# EAGLE design Backplane (EAGLE 4.16)
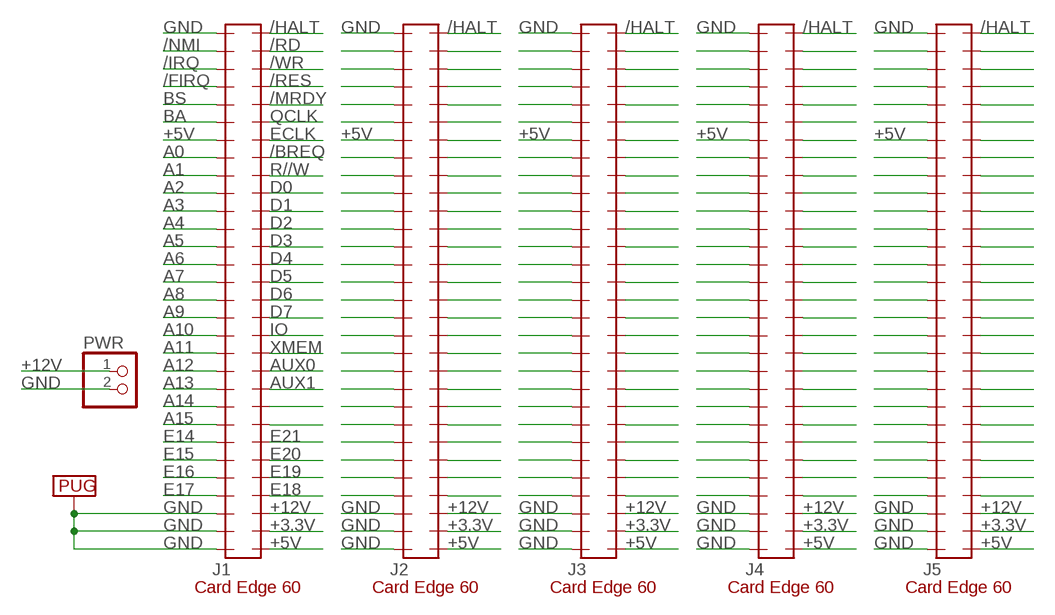
[diagram p0: schematic, sheet 1]

## Parts
J1  CARDEDGE_2.54_60POSSOCKET  [CARDSOCKET_2.54_60POS]
J2  CARDEDGE_2.54_60POSSOCKET  [CARDSOCKET_2.54_60POS]
J3  CARDEDGE_2.54_60POSSOCKET  [CARDSOCKET_2.54_60POS]
J4  CARDEDGE_2.54_60POSSOCKET  [CARDSOCKET_2.54_60POS]
J5  CARDEDGE_2.54_60POSSOCKET  [CARDSOCKET_2.54_60POS]
PWR  PINHD-1X2  [1X02]
U$1  PUGSMALL  [SMALL_PUG]

## Nets
+3.3V [power]: J1.P$32 J2.P$32 J3.P$32 J4.P$32 J5.P$32
+5V [power]: J1.P$7 J1.P$31 J2.P$7 J2.P$31 J3.P$7 J3.P$31 J4.P$7 J4.P$31 J5.P$7 J5.P$31
+12V [power]: J1.P$33 J2.P$33 J3.P$33 J4.P$33 J5.P$33 PWR.1
/BREQ: J1.P$53 J2.P$53 J3.P$53 J4.P$53 J5.P$53
/FIRQ: J1.P$4 J2.P$4 J3.P$4 J4.P$4 J5.P$4
/HALT: J1.P$60 J2.P$60 J3.P$60 J4.P$60 J5.P$60
/IRQ: J1.P$3 J2.P$3 J3.P$3 J4.P$3 J5.P$3
/MRDY: J1.P$56 J2.P$56 J3.P$56 J4.P$56 J5.P$56
/NMI: J1.P$2 J2.P$2 J3.P$2 J4.P$2 J5.P$2
/RD: J1.P$59 J2.P$59 J3.P$59 J4.P$59 J5.P$59
/RES: J1.P$57 J2.P$57 J3.P$57 J4.P$57 J5.P$57
/WR: J1.P$58 J2.P$58 J3.P$58 J4.P$58 J5.P$58
A0: J1.P$8 J2.P$8 J3.P$8 J4.P$8 J5.P$8
A1: J1.P$9 J2.P$9 J3.P$9 J4.P$9 J5.P$9
A2: J1.P$10 J2.P$10 J3.P$10 J4.P$10 J5.P$10
A3: J1.P$11 J2.P$11 J3.P$11 J4.P$11 J5.P$11
A4: J1.P$12 J2.P$12 J3.P$12 J4.P$12 J5.P$12
A5: J1.P$13 J2.P$13 J3.P$13 J4.P$13 J5.P$13
A6: J1.P$14 J2.P$14 J3.P$14 J4.P$14 J5.P$14
A7: J1.P$15 J2.P$15 J3.P$15 J4.P$15 J5.P$15
A8: J1.P$16 J2.P$16 J3.P$16 J4.P$16 J5.P$16
A9: J1.P$17 J2.P$17 J3.P$17 J4.P$17 J5.P$17
A10: J1.P$18 J2.P$18 J3.P$18 J4.P$18 J5.P$18
A11: J1.P$19 J2.P$19 J3.P$19 J4.P$19 J5.P$19
A12: J1.P$20 J2.P$20 J3.P$20 J4.P$20 J5.P$20
A13: J1.P$21 J2.P$21 J3.P$21 J4.P$21 J5.P$21
A14: J1.P$22 J2.P$22 J3.P$22 J4.P$22 J5.P$22
A15: J1.P$23 J2.P$23 J3.P$23 J4.P$23 J5.P$23
AUX0: J1.P$41 J2.P$41 J3.P$41 J4.P$41 J5.P$41
AUX1: J1.P$40 J2.P$40 J3.P$40 J4.P$40 J5.P$40
BA: J1.P$6 J2.P$6 J3.P$6 J4.P$6 J5.P$6
BS: J1.P$5 J2.P$5 J3.P$5 J4.P$5 J5.P$5
D0: J1.P$51 J2.P$51 J3.P$51 J4.P$51 J5.P$51
D1: J1.P$50 J2.P$50 J3.P$50 J4.P$50 J5.P$50
D2: J1.P$49 J2.P$49 J3.P$49 J4.P$49 J5.P$49
D3: J1.P$48 J2.P$48 J3.P$48 J4.P$48 J5.P$48
D4: J1.P$47 J2.P$47 J3.P$47 J4.P$47 J5.P$47
D5: J1.P$46 J2.P$46 J3.P$46 J4.P$46 J5.P$46
D6: J1.P$45 J2.P$45 J3.P$45 J4.P$45 J5.P$45
D7: J1.P$44 J2.P$44 J3.P$44 J4.P$44 J5.P$44
E14: J1.P$24 J2.P$24 J3.P$24 J4.P$24 J5.P$24
E15: J1.P$25 J2.P$25 J3.P$25 J4.P$25 J5.P$25
E16: J1.P$26 J2.P$26 J3.P$26 J4.P$26 J5.P$26
E17: J1.P$27 J2.P$27 J3.P$27 J4.P$27 J5.P$27
E18: J1.P$34 J2.P$34 J3.P$34 J4.P$34 J5.P$34
E19: J1.P$35 J2.P$35 J3.P$35 J4.P$35 J5.P$35
E20: J1.P$36 J2.P$36 J3.P$36 J4.P$36 J5.P$36
E21: J1.P$37 J2.P$37 J3.P$37 J4.P$37 J5.P$37
ECLK: J1.P$54 J2.P$54 J3.P$54 J4.P$54 J5.P$54
GND: J1.P$1 J1.P$28 J1.P$29 J1.P$30 J2.P$1 J2.P$28 J2.P$29 J2.P$30 J3.P$1 J3.P$28 J3.P$29 J3.P$30 J4.P$1 J4.P$28 J4.P$29 J4.P$30 J5.P$1 J5.P$28 J5.P$29 J5.P$30 PWR.2 U$1.P$1
IO: J1.P$43 J2.P$43 J3.P$43 J4.P$43 J5.P$43
N$34: J1.P$38 J2.P$38 J3.P$38 J4.P$38 J5.P$38
N$35: J1.P$39 J2.P$39 J3.P$39 J4.P$39 J5.P$39
QCLK: J1.P$55 J2.P$55 J3.P$55 J4.P$55 J5.P$55
R//W: J1.P$52 J2.P$52 J3.P$52 J4.P$52 J5.P$52
XMEM: J1.P$42 J2.P$42 J3.P$42 J4.P$42 J5.P$42

## Library data of the parts
J1-J5 = 07-Retrocomputing:CARDEDGE_2.54_60POS
PWR = pinhead:PINHD-1X2: PIN HEADER
U$1 = 07-Retrocomputing:PUG

## Net classes
0 default: width 0.203 mm, drill 0.203 mm
1 power: width 0.61 mm, drill 0.305 mm, clearance 0.406 mm

## Board
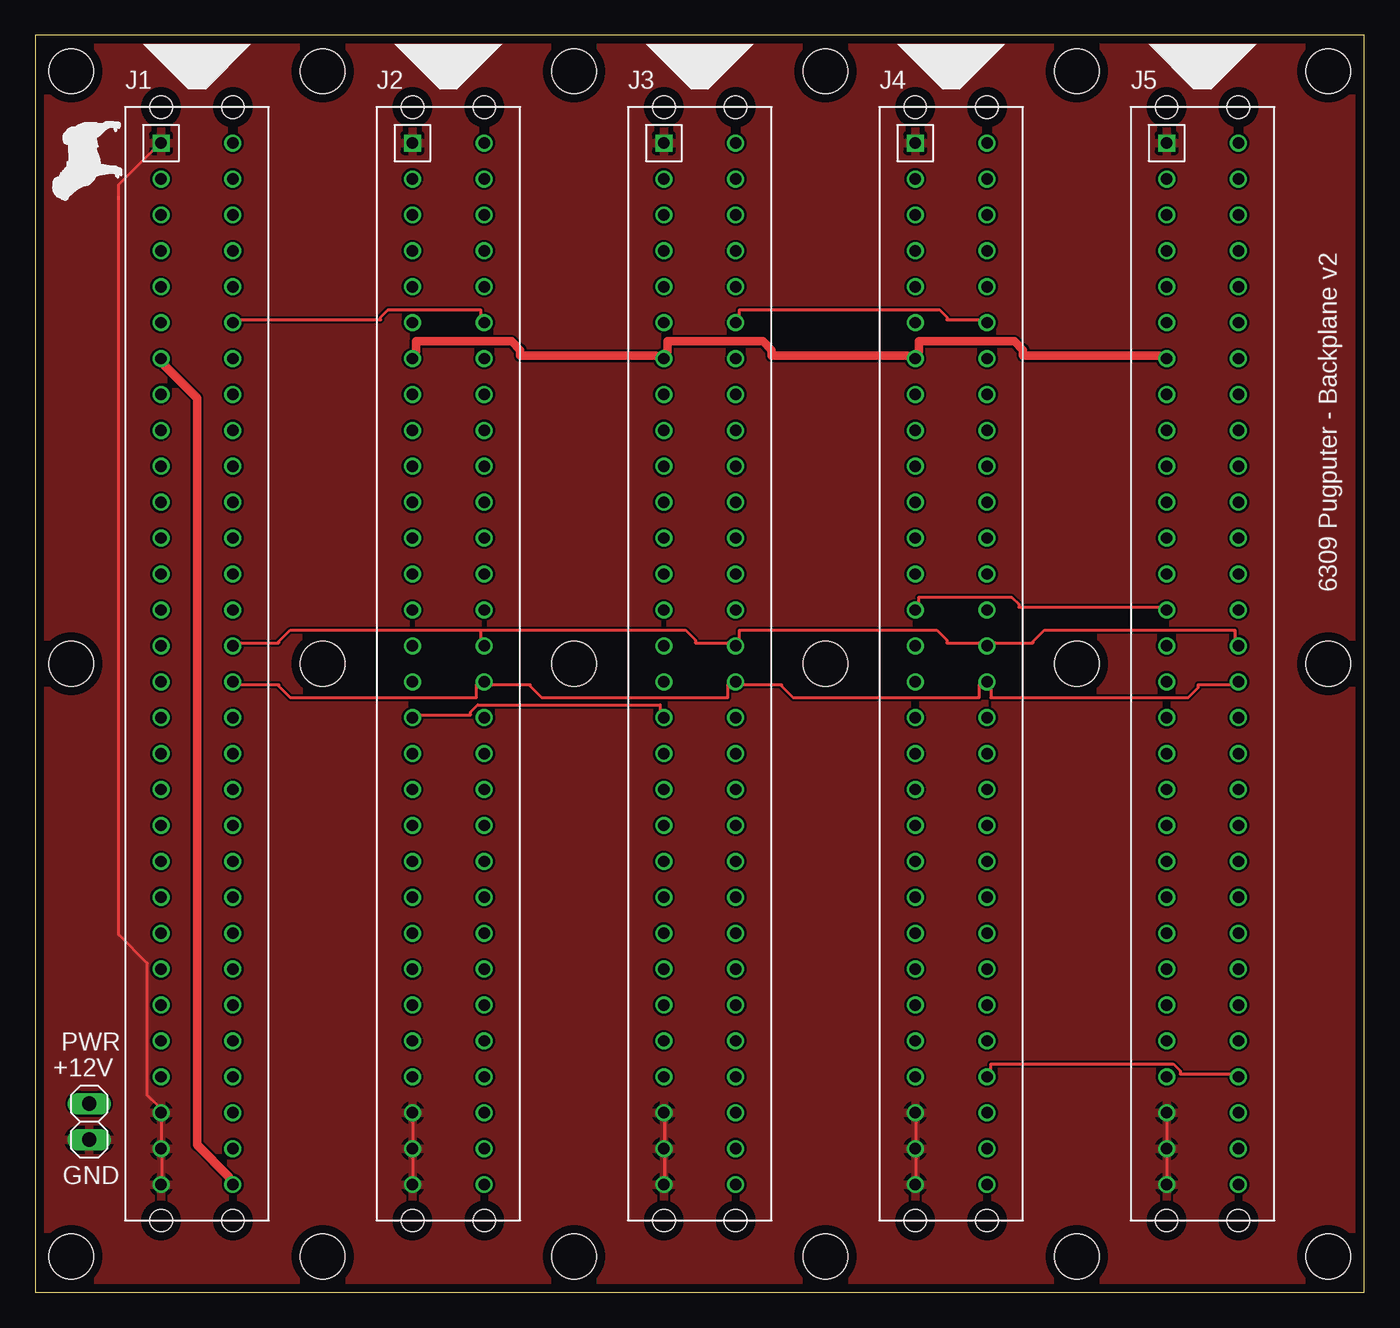
[diagram p1: board, top side]
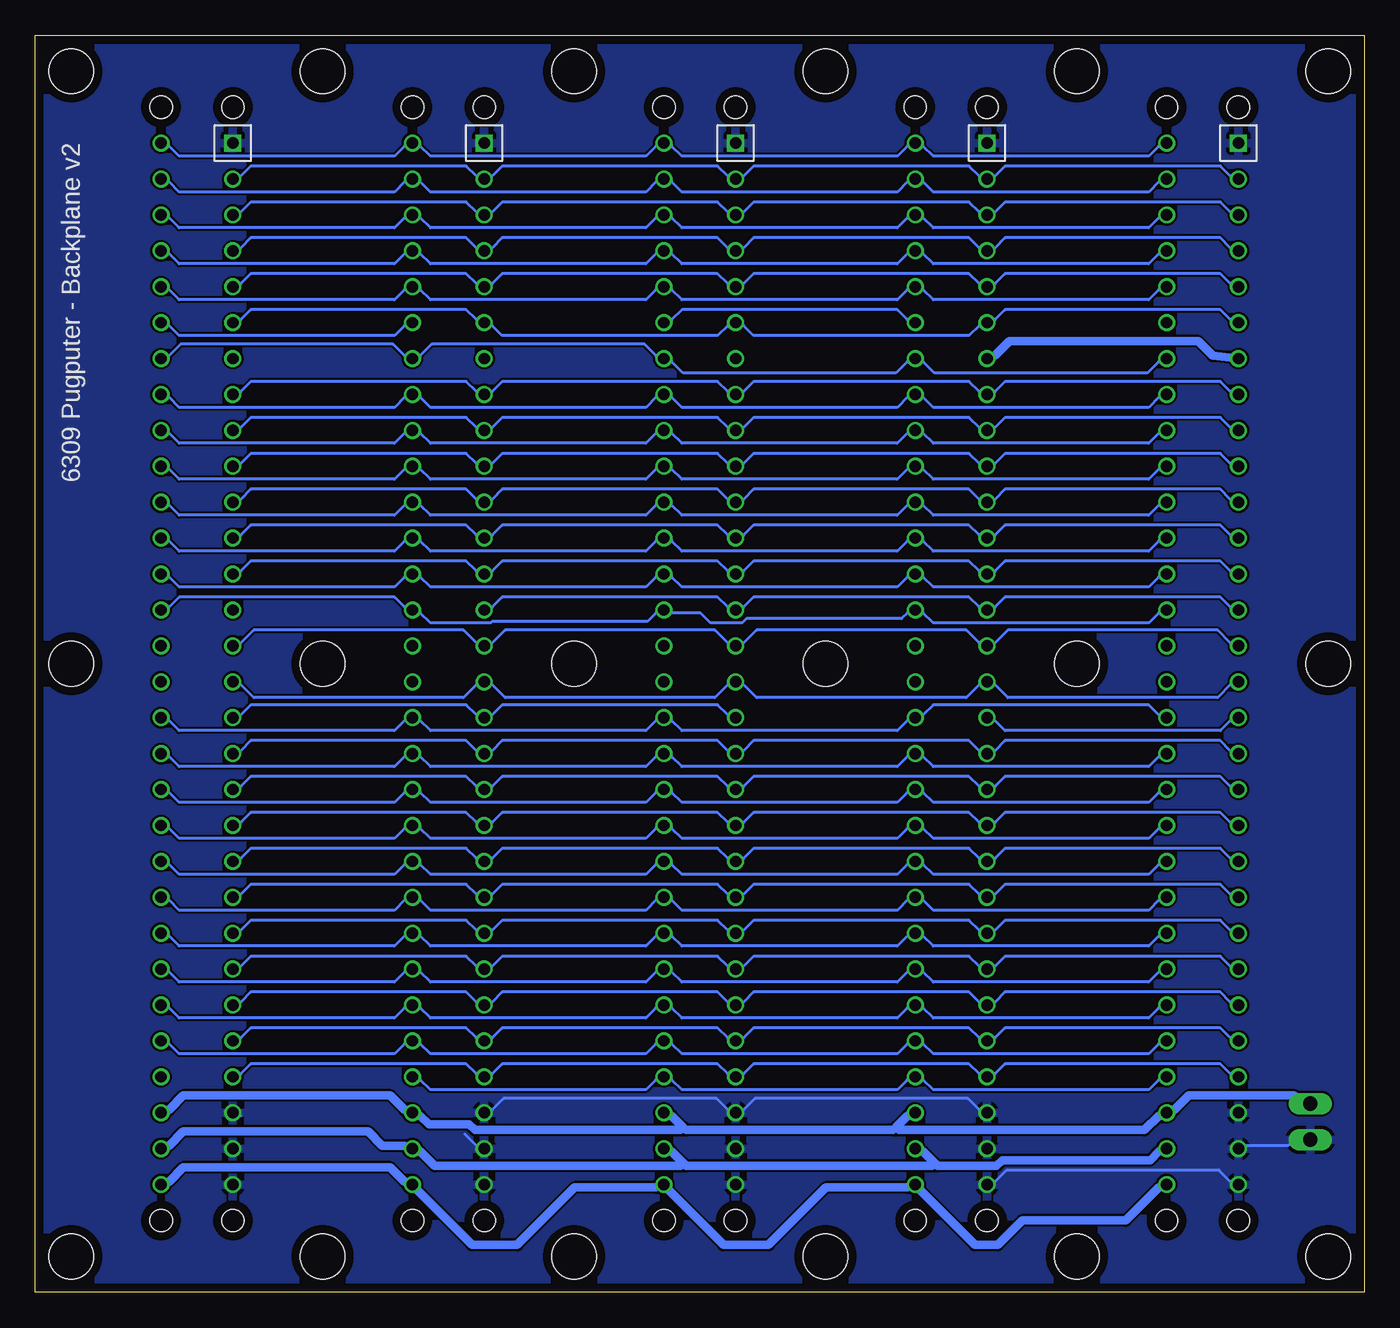
[diagram p2: board, bottom side, seen from below]

Size 93.98 x 88.9 mm. Coordinates in mm from the lower left corner, seen from the top.
Outline: 0,0 93.98,0 93.98,88.9 0,88.9 0,0
Copper layers (1*16): Top 0.0356mm / dielectric 1.6mm / Bottom 0.0356mm
Design rules "oshpark-2layer": minimum track width 6mil, minimum drill 10mil, track to track 6mil, track to pad 6mil, pad to pad 6mil, via to via 6mil, smd to smd 6mil, copper to edge 24mil, drill to drill 24mil, minimum pad ring 5mil, minimum via ring 5mil, stop-mask expansion 2.5mil, vias tented up to drill 0mil, thermal gap 10mil
Holes 3.17 mm at 2.54,86.36 2.54,2.54 91.44,86.36 91.44,2.54 73.66,2.54 55.88,2.54 38.1,2.54 20.32,2.54 20.32,86.36 38.1,86.36 55.88,86.36 73.66,86.36 2.54,44.45 20.32,44.45 38.1,44.45 55.88,44.45 73.66,44.45 91.44,44.45

### Footprints (pad centres in the part's own frame; a part is rotated, then mirrored left to right if it is on the bottom)
CARDSOCKET_2.54_60POS = drill 0.8 square: P$1 -36.83,-2.54 | drill 0.8 round: P$2 -34.29,-2.54; P$3 -31.75,-2.54; P$4 -29.21,-2.54; P$5 -26.67,-2.54; P$6 -24.13,-2.54; P$7 -21.59,-2.54; P$8 -19.05,-2.54; P$9 -16.51,-2.54; P$10 -13.97,-2.54; P$11 -11.43,-2.54; P$12 -8.89,-2.54; P$13 -6.35,-2.54; P$14 -3.81,-2.54; P$15 -1.27,-2.54; P$16 1.27,-2.54; P$17 3.81,-2.54; P$18 6.35,-2.54; P$19 8.89,-2.54; P$20 11.43,-2.54; P$21 13.97,-2.54; P$22 16.51,-2.54; P$23 19.05,-2.54; P$24 21.59,-2.54; P$25 24.13,-2.54; P$26 26.67,-2.54; P$27 29.21,-2.54; P$28 31.75,-2.54; P$29 34.29,-2.54; P$30 36.83,-2.54; P$31 36.83,2.54; P$32 34.29,2.54; P$33 31.75,2.54; P$34 29.21,2.54; P$35 26.67,2.54; P$36 24.13,2.54; P$37 21.59,2.54; P$38 19.05,2.54; P$39 16.51,2.54; P$40 13.97,2.54; P$41 11.43,2.54; P$42 8.89,2.54; P$43 6.35,2.54; P$44 3.81,2.54; P$45 1.27,2.54; P$46 -1.27,2.54; P$47 -3.81,2.54; P$48 -6.35,2.54; P$49 -8.89,2.54; P$50 -11.43,2.54; P$51 -13.97,2.54; P$52 -16.51,2.54; P$53 -19.05,2.54; P$54 -21.59,2.54; P$55 -24.13,2.54; P$56 -26.67,2.54; P$57 -29.21,2.54; P$58 -31.75,2.54; P$59 -34.29,2.54; P$60 -36.83,2.54 | hole 1.587: -39.37,2.54; -39.37,-2.54; 39.37,2.54; 39.37,-2.54
1X02 = drill 1.016 long: 1 -1.27,0; 2 1.27,0
SMALL_PUG = smd 0.203 x 0.203: P$1 0.559,1.105

### Placement (x,y rotation side)
J1  11.43,44.45 270 top
J2  29.21,44.45 270 top
J3  46.99,44.45 270 top
J4  64.77,44.45 270 top
J5  82.55,44.45 270 top
PWR  3.81,12.06 270 top
U$1  6.99,76.83 90 top

### Tracks (layer width: path | path; a pad name or v marks a point on that pad's centre or on a via)
+3.3V
  Bottom 0.61: 30.38,9.14 31.19,9.96 J2.P$32 | 30.38,9.14 30.18,8.94 26.01,8.94 25.6,9.35 15.14,9.35 14.53,9.96 J1.P$32 | 48.16,9.14 47.95,8.94 30.58,8.94 30.38,9.14 | 48.16,9.14 48.97,9.96 J3.P$32 | 48.16,9.14 48.36,8.94 65.73,8.94 66.75,9.96 J4.P$32 67.87,10.36 69.44,10.36 70.46,11.38 83.52,11.38 84.53,10.36 J5.P$32
+5V
  Top 0.61: J2.P$7 26.92,66.55 26.92,67.26 33.68,67.26 34.29,66.65 34.29,66.24 43.89,66.24 J3.P$7 44.7,66.55 44.7,67.26 51.46,67.26 52.07,66.65 52.07,66.24 61.67,66.24 J4.P$7 62.48,66.55 62.48,67.26 69.24,67.26 69.85,66.65 69.85,66.24 79.45,66.24 J5.P$7 | J1.P$7 9.14,65.53 11.43,63.25 11.43,10.41 13.72,8.13 J1.P$31
  Bottom 0.61: J1.P$7 10.72,66.24 11.73,67.26 25.09,67.26 26.11,66.24 J2.P$7 | J5.P$31 84.53,7.82 83.52,8.84 68.89,8.84 67.87,7.82 J4.P$31 66.95,7.21 63.09,3.35 59.89,3.35 55.83,7.42 50.09,7.42 J3.P$31 49.17,7.21 45.31,3.35 42.11,3.35 38.05,7.42 32.31,7.42 J2.P$31 31.39,7.21 27.53,3.35 25.91,3.35 24.18,5.08 16.87,5.08 14.53,7.42 J1.P$31
+12V
  Bottom 0.61: J5.P$33 84.53,12.9 83.52,13.92 68.89,13.92 67.87,12.9 J4.P$33 66.75,12.5 66.14,11.89 63.3,11.89 62.89,11.48 48.36,11.48 48.16,11.68 | PWR.1 4.98,13.92 12.39,13.92 13.41,12.9 J1.P$33 14.53,12.5 15.54,11.48 32.92,11.48 33.12,11.68 | 33.12,11.68 33.33,11.48 47.95,11.48 48.16,11.68 | 33.12,11.68 32.31,12.5 J2.P$33 | 48.16,11.68 48.97,12.5 J3.P$33
/BREQ
  Bottom 0.203: J1.P$53 14.53,63.3 15.24,62.59 30.48,62.59 31.19,63.3 J2.P$53 32.31,63.3 33.02,62.59 48.26,62.59 48.97,63.3 J3.P$53 50.09,63.3 50.8,62.59 66.04,62.59 66.75,63.3 J4.P$53 67.87,63.3 68.58,62.59 83.82,62.59 84.53,63.3 J5.P$53
/FIRQ
  Bottom 0.203: J1.P$4 9.45,73.86 10.16,74.57 25.4,74.57 26.11,73.86 J2.P$4 27.23,73.86 27.94,74.57 43.18,74.57 43.89,73.86 J3.P$4 45.01,73.86 45.72,74.57 60.96,74.57 61.67,73.86 J4.P$4 62.79,73.86 63.5,74.57 78.74,74.57 79.45,73.86 J5.P$4
/HALT
  Bottom 0.203: J1.P$60 14.53,81.08 15.24,80.37 30.48,80.37 31.19,81.08 J2.P$60 32.31,81.08 33.02,80.37 48.26,80.37 48.97,81.08 J3.P$60 50.09,81.08 50.8,80.37 66.04,80.37 66.75,81.08 J4.P$60 67.87,81.08 68.58,80.37 83.82,80.37 84.53,81.08 J5.P$60
/IRQ
  Bottom 0.203: J1.P$3 9.45,76.4 10.16,77.11 25.4,77.11 26.11,76.4 J2.P$3 27.23,76.4 27.94,77.11 43.18,77.11 43.89,76.4 J3.P$3 45.01,76.4 45.72,77.11 60.96,77.11 61.67,76.4 J4.P$3 62.79,76.4 63.5,77.11 78.74,77.11 79.45,76.4 J5.P$3
/MRDY
  Bottom 0.203: J1.P$56 14.53,70.92 15.24,70.21 30.48,70.21 31.19,70.92 J2.P$56 32.31,70.92 33.02,70.21 48.26,70.21 48.97,70.92 J3.P$56 50.09,70.92 50.8,70.21 66.04,70.21 66.75,70.92 J4.P$56 67.87,70.92 68.58,70.21 83.82,70.21 84.53,70.92 J5.P$56
/NMI
  Bottom 0.203: J1.P$2 9.45,78.94 10.16,79.65 25.4,79.65 26.11,78.94 J2.P$2 27.23,78.94 27.94,79.65 43.18,79.65 43.89,78.94 J3.P$2 45.01,78.94 45.72,79.65 60.96,79.65 61.67,78.94 J4.P$2 62.79,78.94 63.5,79.65 78.74,79.65 79.45,78.94 J5.P$2
/RD
  Bottom 0.203: J1.P$59 14.53,78.54 15.24,77.83 30.48,77.83 31.19,78.54 J2.P$59 32.31,78.54 33.02,77.83 48.26,77.83 48.97,78.54 J3.P$59 50.09,78.54 50.8,77.83 66.04,77.83 66.75,78.54 J4.P$59 67.87,78.54 68.58,77.83 83.82,77.83 84.53,78.54 J5.P$59
/RES
  Bottom 0.203: J1.P$57 14.53,73.46 15.24,72.75 30.48,72.75 31.19,73.46 J2.P$57 32.31,73.46 33.02,72.75 48.26,72.75 48.97,73.46 J3.P$57 50.09,73.46 50.8,72.75 66.04,72.75 66.75,73.46 J4.P$57 67.87,73.46 68.58,72.75 83.82,72.75 84.53,73.46 J5.P$57
/WR
  Bottom 0.203: J1.P$58 14.53,76 15.24,75.29 30.48,75.29 31.19,76 J2.P$58 32.31,76 33.02,75.29 48.26,75.29 48.97,76 J3.P$58 50.09,76 50.8,75.29 66.04,75.29 66.75,76 J4.P$58 67.87,76 68.58,75.29 83.82,75.29 84.53,76 J5.P$58
A0
  Bottom 0.203: J1.P$8 9.45,63.7 10.16,64.41 25.4,64.41 26.11,63.7 J2.P$8 27.23,63.7 27.94,64.41 43.18,64.41 43.89,63.7 J3.P$8 45.01,63.7 45.72,64.41 60.96,64.41 61.67,63.7 J4.P$8 62.79,63.7 63.5,64.41 78.74,64.41 79.45,63.7 J5.P$8
A1
  Bottom 0.203: J1.P$9 9.45,61.16 10.16,61.87 25.4,61.87 26.11,61.16 J2.P$9 27.23,61.16 27.94,61.87 43.18,61.87 43.89,61.16 J3.P$9 45.01,61.16 45.72,61.87 60.96,61.87 61.67,61.16 J4.P$9 62.79,61.16 63.5,61.87 78.74,61.87 79.45,61.16 J5.P$9
A2
  Bottom 0.203: J1.P$10 9.45,58.62 10.16,59.33 25.4,59.33 26.11,58.62 J2.P$10 27.23,58.62 27.94,59.33 43.18,59.33 43.89,58.62 J3.P$10 45.01,58.62 45.72,59.33 60.96,59.33 61.67,58.62 J4.P$10 62.79,58.62 63.5,59.33 78.74,59.33 79.45,58.62 J5.P$10
A3
  Bottom 0.203: J1.P$11 9.45,56.08 10.16,56.79 25.4,56.79 26.11,56.08 J2.P$11 27.23,56.08 27.94,56.79 43.18,56.79 43.89,56.08 J3.P$11 45.01,56.08 45.72,56.79 60.96,56.79 61.67,56.08 J4.P$11 62.79,56.08 63.5,56.79 78.74,56.79 79.45,56.08 J5.P$11
A4
  Bottom 0.203: J1.P$12 9.45,53.54 10.16,54.25 25.4,54.25 26.11,53.54 J2.P$12 27.23,53.54 27.94,54.25 43.18,54.25 43.89,53.54 J3.P$12 45.01,53.54 45.72,54.25 60.96,54.25 61.67,53.54 J4.P$12 62.79,53.54 63.5,54.25 78.74,54.25 79.45,53.54 J5.P$12
A5
  Bottom 0.203: J1.P$13 9.45,51 10.16,51.71 25.4,51.71 26.11,51 J2.P$13 27.23,51 27.94,51.71 43.18,51.71 43.89,51 J3.P$13 45.01,51 45.72,51.71 60.96,51.71 61.67,51 J4.P$13 62.79,51 63.5,51.71 78.74,51.71 79.45,51 J5.P$13
A6
  Top 0.203: J5.P$14 79.45,48.46 69.55,48.46 69.55,48.67 69.04,49.17 62.48,49.17 62.48,48.77 J4.P$14
  Bottom 0.203: J1.P$14 9.45,48.46 10.16,49.17 25.4,49.17 26.11,48.46 J2.P$14 27.23,48.46 27.94,49.17 43.18,49.17 43.89,48.46 J3.P$14 45.01,48.46 45.72,49.17 60.96,49.17 61.67,48.46 J4.P$14
A7
  Bottom 0.203: J1.P$15 9.45,45.92 10.36,46.84 25.2,46.84 26.11,45.92 J2.P$15 27.23,45.92 28.14,46.84 42.98,46.84 43.89,45.92 J3.P$15 45.01,45.92 45.92,46.84 60.76,46.84 61.67,45.92 J4.P$15 62.79,45.92 63.7,46.84 78.54,46.84 79.45,45.92 J5.P$15
A8
  Bottom 0.203: J1.P$16 9.45,42.98 10.36,42.06 25.2,42.06 26.11,42.98 J2.P$16 27.23,42.98 28.14,42.06 42.98,42.06 43.89,42.98 J3.P$16 45.01,42.98 45.92,42.06 60.76,42.06 61.67,42.98 J4.P$16 62.79,42.98 63.7,42.06 78.54,42.06 79.45,42.98 J5.P$16
A9
  Top 0.203: J2.P$17 27.23,40.84 30.79,40.84 30.79,41.05 31.29,41.55 44.2,41.55 44.2,41.15 J3.P$17
  Bottom 0.203: J1.P$17 9.45,40.44 10.16,39.73 25.4,39.73 26.11,40.44 J2.P$17 | J3.P$17 45.01,40.84 45.72,41.55 60.96,41.55 61.67,40.84 J4.P$17 62.79,40.84 63.5,41.55 78.74,41.55 79.45,40.84 J5.P$17
A10
  Bottom 0.203: J1.P$18 9.45,38.3 10.16,39.01 25.4,39.01 26.11,38.3 J2.P$18 27.23,38.3 27.94,39.01 43.18,39.01 43.89,38.3 J3.P$18 45.01,38.3 45.72,39.01 60.96,39.01 61.67,38.3 J4.P$18 62.79,38.3 63.5,39.01 78.74,39.01 79.45,38.3 J5.P$18
A11
  Bottom 0.203: J1.P$19 9.45,35.76 10.16,36.47 25.4,36.47 26.11,35.76 J2.P$19 27.23,35.76 27.94,36.47 43.18,36.47 43.89,35.76 J3.P$19 45.01,35.76 45.72,36.47 60.96,36.47 61.67,35.76 J4.P$19 62.79,35.76 63.5,36.47 78.74,36.47 79.45,35.76 J5.P$19
A12
  Bottom 0.203: J1.P$20 9.45,33.22 10.16,33.93 25.4,33.93 26.11,33.22 J2.P$20 27.23,33.22 27.94,33.93 43.18,33.93 43.89,33.22 J3.P$20 45.01,33.22 45.72,33.93 60.96,33.93 61.67,33.22 J4.P$20 62.79,33.22 63.5,33.93 78.74,33.93 79.45,33.22 J5.P$20
A13
  Bottom 0.203: J1.P$21 9.45,30.68 10.16,31.39 25.4,31.39 26.11,30.68 J2.P$21 27.23,30.68 27.94,31.39 43.18,31.39 43.89,30.68 J3.P$21 45.01,30.68 45.72,31.39 60.96,31.39 61.67,30.68 J4.P$21 62.79,30.68 63.5,31.39 78.74,31.39 79.45,30.68 J5.P$21
A14
  Bottom 0.203: J1.P$22 9.45,28.14 10.16,28.85 25.4,28.85 26.11,28.14 J2.P$22 27.23,28.14 27.94,28.85 43.18,28.85 43.89,28.14 J3.P$22 45.01,28.14 45.72,28.85 60.96,28.85 61.67,28.14 J4.P$22 62.79,28.14 63.5,28.85 78.74,28.85 79.45,28.14 J5.P$22
A15
  Bottom 0.203: J1.P$23 9.45,25.6 10.16,26.31 25.4,26.31 26.11,25.6 J2.P$23 27.23,25.6 27.94,26.31 43.18,26.31 43.89,25.6 J3.P$23 45.01,25.6 45.72,26.31 60.96,26.31 61.67,25.6 J4.P$23 62.79,25.6 63.5,26.31 78.74,26.31 79.45,25.6 J5.P$23
AUX0
  Bottom 0.203: J1.P$41 14.53,32.82 15.24,32.11 30.48,32.11 31.19,32.82 J2.P$41 32.31,32.82 33.02,32.11 48.26,32.11 48.97,32.82 J3.P$41 50.09,32.82 50.8,32.11 66.04,32.11 66.75,32.82 J4.P$41 67.87,32.82 68.58,32.11 83.82,32.11 84.53,32.82 J5.P$41
AUX1
  Bottom 0.203: J5.P$40 84.53,30.28 83.82,29.57 68.58,29.57 67.87,30.28 J4.P$40 66.75,30.28 66.04,29.57 50.8,29.57 50.09,30.28 J3.P$40 48.97,30.28 48.26,29.57 33.02,29.57 32.31,30.28 J2.P$40 31.19,30.28 30.48,29.57 15.24,29.57 14.53,30.28 J1.P$40
BA
  Bottom 0.203: J1.P$6 9.45,68.78 10.16,69.49 25.4,69.49 26.11,68.78 J2.P$6 27.23,68.38 27.94,67.67 43.18,67.67 43.89,68.38 J3.P$6 45.01,68.38 45.72,67.67 60.96,67.67 61.67,68.38 J4.P$6 62.79,68.78 63.5,69.49 78.74,69.49 79.45,68.78 J5.P$6
BS
  Bottom 0.203: J1.P$5 9.45,71.32 10.16,72.03 25.4,72.03 26.11,71.32 J2.P$5 27.23,71.32 27.94,72.03 43.18,72.03 43.89,71.32 J3.P$5 45.01,71.32 45.72,72.03 60.96,72.03 61.67,71.32 J4.P$5 62.79,71.32 63.5,72.03 78.74,72.03 79.45,71.32 J5.P$5
D0
  Bottom 0.203: J1.P$51 14.53,58.22 15.24,57.51 30.48,57.51 31.19,58.22 J2.P$51 32.31,58.22 33.02,57.51 48.26,57.51 48.97,58.22 J3.P$51 50.09,58.22 50.8,57.51 66.04,57.51 66.75,58.22 J4.P$51 67.87,58.22 68.58,57.51 83.82,57.51 84.53,58.22 J5.P$51
D1
  Bottom 0.203: J1.P$50 14.53,55.68 15.24,54.97 30.48,54.97 31.19,55.68 J2.P$50 32.31,55.68 33.02,54.97 48.26,54.97 48.97,55.68 J3.P$50 50.09,55.68 50.8,54.97 66.04,54.97 66.75,55.68 J4.P$50 67.87,55.68 68.58,54.97 83.82,54.97 84.53,55.68 J5.P$50
D2
  Bottom 0.203: J1.P$49 14.53,53.14 15.24,52.43 30.48,52.43 31.19,53.14 J2.P$49 32.31,53.14 33.02,52.43 48.26,52.43 48.97,53.14 J3.P$49 50.09,53.14 50.8,52.43 66.04,52.43 66.75,53.14 J4.P$49 67.87,53.14 68.58,52.43 83.82,52.43 84.53,53.14 J5.P$49
D3
  Bottom 0.203: J1.P$48 14.53,50.6 15.24,49.89 30.48,49.89 31.19,50.6 J2.P$48 32.31,50.6 33.02,49.89 48.26,49.89 48.97,50.6 J3.P$48 50.09,50.6 50.8,49.89 66.04,49.89 66.75,50.6 J4.P$48 67.87,50.6 68.58,49.89 83.82,49.89 84.53,50.6 J5.P$48
D4
  Bottom 0.203: J1.P$47 14.53,48.06 15.24,47.35 30.48,47.35 31.19,48.06 J2.P$47 32.31,48.06 32.72,47.65 43.69,47.65 43.99,47.35 46.23,47.35 46.94,48.06 48.97,48.06 J3.P$47 50.09,48.06 50.7,47.45 61.67,47.45 61.77,47.35 66.04,47.35 66.75,48.06 J4.P$47 67.87,48.46 68.58,49.17 83.82,49.17 84.53,48.46 J5.P$47
D5
  Top 0.203: J5.P$46 84.84,46.23 84.84,46.84 71.37,46.84 70.56,46.02 70.56,45.92 67.87,45.92 J4.P$46 66.75,45.92 64.47,45.92 64.47,46.13 63.75,46.84 49.78,46.84 49.78,46.23 J3.P$46 48.97,45.92 46.69,45.92 46.69,46.13 45.97,46.84 31.5,46.84 | 31.5,46.84 18.03,46.84 17.22,46.02 17.22,45.92 14.53,45.92 J1.P$46 | 31.5,46.84 31.5,46.23 J2.P$46
D6
  Top 0.203: J1.P$45 14.53,42.98 17.22,42.98 17.22,42.88 18.03,42.06 31.19,42.06 31.19,42.98 J2.P$45 32.31,42.98 35,42.98 35,42.88 35.81,42.06 48.97,42.06 48.97,42.98 J3.P$45 50.09,42.98 52.78,42.98 52.78,42.88 53.59,42.06 66.75,42.06 66.75,42.98 J4.P$45 67.56,42.67 67.56,42.06 81.53,42.06 82.25,42.77 82.25,42.98 84.53,42.98 J5.P$45
D7
  Bottom 0.203: J1.P$44 14.53,40.84 15.24,41.55 30.48,41.55 31.19,40.84 J2.P$44 32.31,40.44 33.02,39.73 48.26,39.73 48.97,40.44 J3.P$44 50.09,40.44 50.8,39.73 66.04,39.73 66.75,40.44 J4.P$44 67.87,40.44 68.58,39.73 83.82,39.73 84.53,40.44 J5.P$44
E14
  Bottom 0.203: J1.P$24 9.45,23.06 10.16,23.77 25.4,23.77 26.11,23.06 J2.P$24 27.23,23.06 27.94,23.77 43.18,23.77 43.89,23.06 J3.P$24 45.01,23.06 45.72,23.77 60.96,23.77 61.67,23.06 J4.P$24 62.79,23.06 63.5,23.77 78.74,23.77 79.45,23.06 J5.P$24
E15
  Bottom 0.203: J1.P$25 9.45,20.52 10.16,21.23 25.4,21.23 26.11,20.52 J2.P$25 27.23,20.52 27.94,21.23 43.18,21.23 43.89,20.52 J3.P$25 45.01,20.52 45.72,21.23 60.96,21.23 61.67,20.52 J4.P$25 62.79,20.52 63.5,21.23 78.74,21.23 79.45,20.52 J5.P$25
E16
  Bottom 0.203: J1.P$26 9.45,17.98 10.16,18.69 25.4,18.69 26.11,17.98 J2.P$26 27.23,17.98 27.94,18.69 43.18,18.69 43.89,17.98 J3.P$26 45.01,17.98 45.72,18.69 60.96,18.69 61.67,17.98 J4.P$26 62.79,17.98 63.5,18.69 78.74,18.69 79.45,17.98 J5.P$26
E17
  Bottom 0.203: J1.P$27 9.45,15.44 10.16,16.15 25.4,16.15 26.11,15.44 J2.P$27 27.23,15.44 27.94,16.15 43.18,16.15 43.89,15.44 J3.P$27 45.01,15.44 45.72,16.15 60.96,16.15 61.67,15.44 J4.P$27 62.79,15.44 63.5,16.15 78.74,16.15 79.45,15.44 J5.P$27
E18
  Top 0.203: J5.P$34 84.53,15.44 80.97,15.44 80.97,15.65 80.47,16.15 67.56,16.15 67.56,15.75 J4.P$34
  Bottom 0.203: J1.P$34 14.53,15.04 15.24,14.33 30.48,14.33 31.19,15.04 J2.P$34 32.31,15.04 33.02,14.33 48.26,14.33 48.97,15.04 J3.P$34 50.09,15.04 50.8,14.33 66.04,14.33 66.75,15.04 J4.P$34
E19
  Bottom 0.203: J1.P$35 14.53,17.58 15.24,16.87 30.48,16.87 31.19,17.58 J2.P$35 32.31,17.58 33.02,16.87 48.26,16.87 48.97,17.58 J3.P$35 50.09,17.58 50.8,16.87 66.04,16.87 66.75,17.58 J4.P$35 67.87,17.58 68.58,16.87 83.82,16.87 84.53,17.58 J5.P$35
E20
  Bottom 0.203: J1.P$36 14.53,20.12 15.24,19.41 30.48,19.41 31.19,20.12 J2.P$36 32.31,20.12 33.02,19.41 48.26,19.41 48.97,20.12 J3.P$36 50.09,20.12 50.8,19.41 66.04,19.41 66.75,20.12 J4.P$36 67.87,20.12 68.58,19.41 83.82,19.41 84.53,20.12 J5.P$36
E21
  Bottom 0.203: J1.P$37 14.53,22.66 15.24,21.95 30.48,21.95 31.19,22.66 J2.P$37 32.31,22.66 33.02,21.95 48.26,21.95 48.97,22.66 J3.P$37 50.09,22.66 50.8,21.95 66.04,21.95 66.75,22.66 J4.P$37 67.87,22.66 68.58,21.95 83.82,21.95 84.53,22.66 J5.P$37
ECLK
  Bottom 0.203: J1.P$54 14.53,65.84 15.34,65.02 30.38,65.02 31.19,65.84 J2.P$54 32.31,65.84 33.12,65.02 48.16,65.02 48.97,65.84 J3.P$54 50.09,66.24 50.9,67.06 65.94,67.06 66.75,66.24 J4.P$54 67.87,66.24 68.68,67.06 83.72,67.06 84.53,66.24 J5.P$54
GND
  Top 0.203: J1.P$30 8.94,8.13 8.94,9.65 J1.P$29 8.94,10.67 8.94,12.19 J1.P$28 8.64,13.21 7.92,13.92 7.92,23.27 5.89,25.3 | J5.P$30 80.06,8.13 80.06,9.65 J5.P$29 80.06,10.67 80.06,12.19 J5.P$28 | J4.P$30 62.28,8.13 62.28,9.65 J4.P$29 62.28,10.67 62.28,12.19 J4.P$28 | J2.P$30 26.72,8.13 26.72,9.65 J2.P$29 26.72,10.67 26.72,12.19 J2.P$28 | J3.P$30 44.5,8.13 44.5,9.65 J3.P$29 44.5,10.67 44.5,12.19 J3.P$28 | 5.89,25.4 5.89,78.33 8.33,80.77 J1.P$1
  Bottom 0.203: PWR.2 5.28,10.46 5.38,10.36 8.33,10.36 J1.P$29 | J2.P$28 27.23,12.9 28.04,13.72 43.08,13.72 43.89,12.9 J3.P$28 45.01,12.9 45.82,13.72 60.86,13.72 61.67,12.9 J4.P$28 | 63.6,11.18 62.79,10.36 J4.P$29 | J5.P$28 79.45,12.5 | J1.P$30 9.45,7.82 10.26,8.64 25.3,8.64 26.11,7.82 J2.P$30
  pour Top: 0,88.9 93.98,88.9 93.98,0 0,0
  pour Bottom: 0,88.9 93.98,88.9 93.98,0 0,0
IO
  Bottom 0.203: J1.P$43 14.53,37.9 15.24,37.19 30.48,37.19 31.19,37.9 J2.P$43 32.31,37.9 33.02,37.19 48.26,37.19 48.97,37.9 J3.P$43 50.09,37.9 50.8,37.19 66.04,37.19 66.75,37.9 J4.P$43 67.87,37.9 68.58,37.19 83.82,37.19 84.53,37.9 J5.P$43
N$34
  Bottom 0.203: J1.P$38 14.53,25.2 15.24,24.49 30.48,24.49 31.19,25.2 J2.P$38 32.31,25.2 33.02,24.49 48.26,24.49 48.97,25.2 J3.P$38 50.09,25.2 50.8,24.49 66.04,24.49 66.75,25.2 J4.P$38 67.87,25.2 68.58,24.49 83.82,24.49 84.53,25.2 J5.P$38
N$35
  Bottom 0.203: J1.P$39 14.53,27.74 15.24,27.03 30.48,27.03 31.19,27.74 J2.P$39 32.31,27.74 33.02,27.03 48.26,27.03 48.97,27.74 J3.P$39 50.09,27.74 50.8,27.03 66.04,27.03 66.75,27.74 J4.P$39 67.87,27.74 68.58,27.03 83.82,27.03 84.53,27.74 J5.P$39
QCLK
  Top 0.203: J1.P$55 14.53,68.78 24.43,68.78 24.43,68.99 24.94,69.49 31.5,69.49 31.5,69.09 J2.P$55 | J4.P$55 66.75,68.78 64.47,68.78 64.47,68.99 63.96,69.49 49.78,69.49 49.78,69.09 J3.P$55
  Bottom 0.203: J4.P$55 67.87,68.38 68.58,67.67 83.82,67.67 84.53,68.38 J5.P$55 | J3.P$55 48.97,68.78 48.26,69.49 33.02,69.49 32.31,68.78 J2.P$55
R//W
  Bottom 0.203: J1.P$52 14.53,60.76 15.24,60.05 30.48,60.05 31.19,60.76 J2.P$52 32.31,60.76 33.02,60.05 48.26,60.05 48.97,60.76 J3.P$52 50.09,60.76 50.8,60.05 66.04,60.05 66.75,60.76 J4.P$52 67.87,60.76 68.58,60.05 83.82,60.05 84.53,60.76 J5.P$52
XMEM
  Bottom 0.203: J1.P$42 14.53,35.36 15.24,34.65 30.48,34.65 31.19,35.36 J2.P$42 32.31,35.36 33.02,34.65 48.26,34.65 48.97,35.36 J3.P$42 50.09,35.36 50.8,34.65 66.04,34.65 66.75,35.36 J4.P$42 67.87,35.36 68.58,34.65 83.82,34.65 84.53,35.36 J5.P$42

### Text on the board
tPlace: 6309 Pugputer - Backplane v2 | +12V | GND
bPlace: 6309 Pugputer - Backplane v2